# Altium schematic sheet Four_Axis_Remoter_V1.0.0.SchDoc
size A3
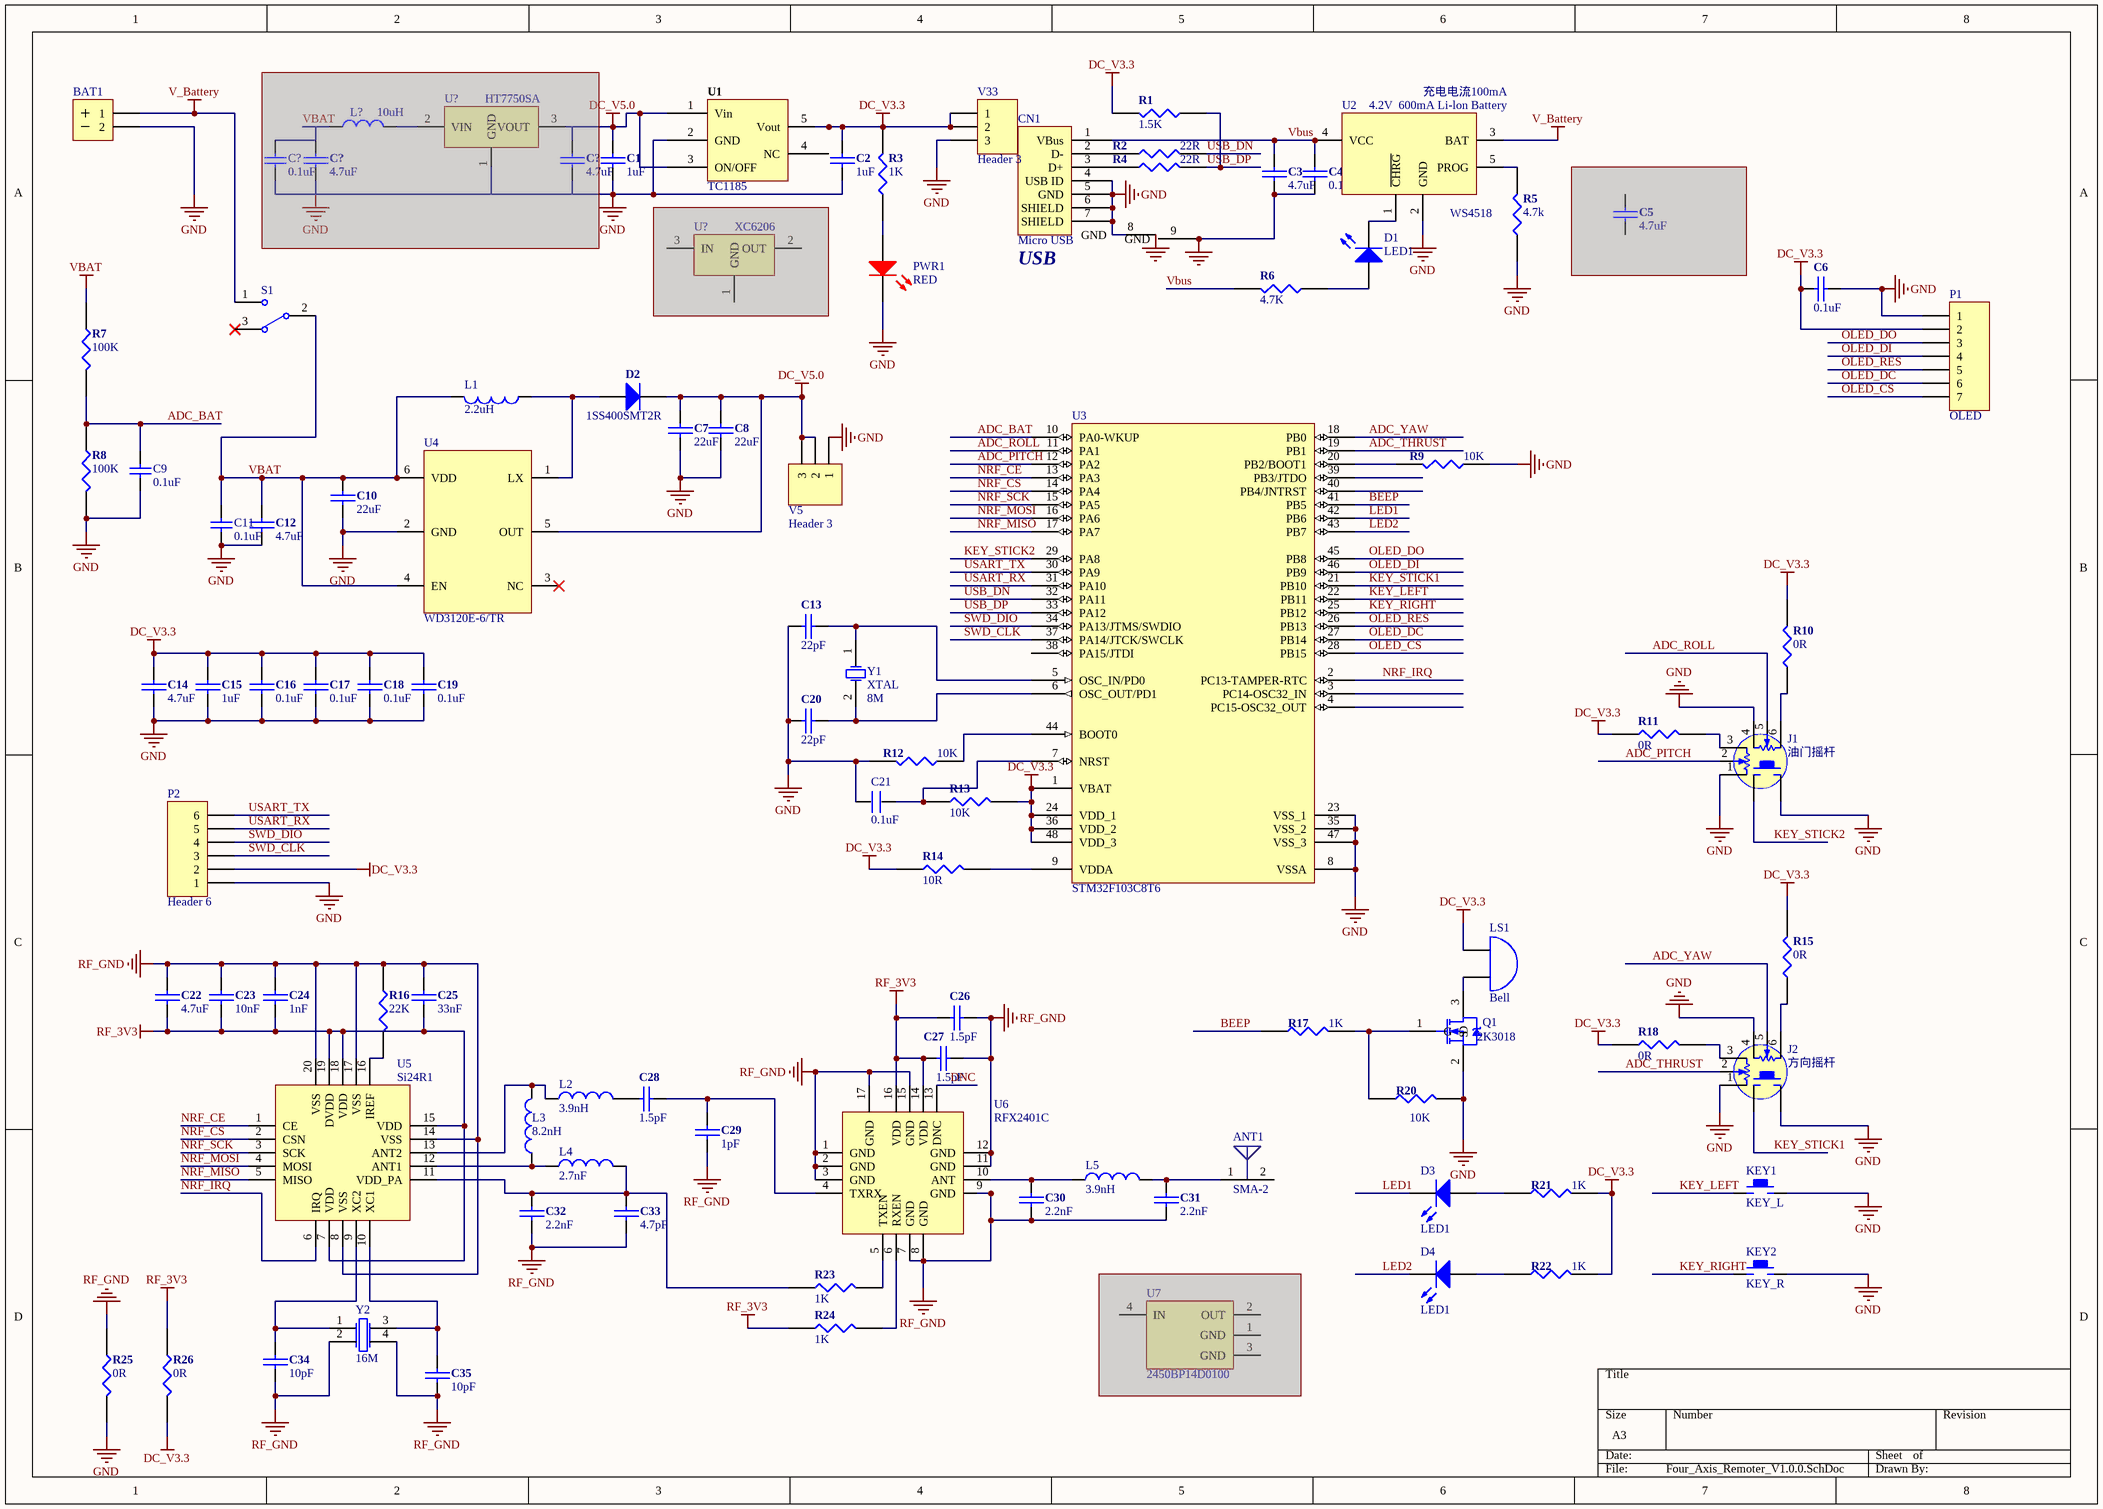
[diagram p0: Four_Axis_Remoter_V1.0.0.SchDoc]

## Parts
(Parts that share a designator on the sheet are numbered #1, #2 ... from top to bottom, then left to right.)
ANT1  SMA-2  [SMB_V-RJ45]
BAT1  BAT  [HDR1X2]  (value not drawn)
C1  1uF  [C0603]
C2  1uF  [C0603]
C3  4.7uF  [C0603]
C4  0.1uF  [C0603]
C5  4.7uF  [C0603]  (masked out: inside a compile mask, not in the netlist)
C6  0.1uF  [C0603]
C7  22uF  [C0603]
C8  22uF  [C0603]
C9  value 0.1uF  [C0603]  (hidden comment: C_0603)
C10  22uF  [C0603]
C11  value 0.1uF  [C0603]  (hidden comment: C_0603)
C12  4.7uF  [C0603]
C13  22pF  [C0603]
C14  4.7uF  [C0603]
C15  1uF  [C0603]
C16  0.1uF  [C0603]
C17  0.1uF  [C0603]
C18  0.1uF  [C0603]
C19  0.1uF  [C0603]
C20  22pF  [C0603]
C21  0.1uF  [C0603]
C22  4.7uF  [C0603]
C23  10nF  [C0603]
C24  1nF  [C0603]
C25  33nF  [C0603]
C26  1.5pF  [C0603]
C27  1.5pF  [C0603]
C28  1.5pF  [C0603]
C29  1pF  [C0603]
C30  2.2nF  [C0603]
C31  2.2nF  [C0603]
C32  2.2nF  [C0603]
C33  4.7pF  [C0603]
C34  10pF  [C0603]
C35  10pF  [C0603]
C?#1  4.7uF  [CC0402]  (masked out: inside a compile mask, not in the netlist)
C?#2  4.7uF  [CC0402]  (masked out: inside a compile mask, not in the netlist)
C?#3  value 0.1uF  [C0603]  (hidden comment: C_0603)  (masked out: inside a compile mask, not in the netlist)
CN1  Micro USB  USAGE: USB  [MICRO_USB_9]
D1  LED1  [LED0603-green]
D2  1SS400SMT2R  [L0603]
D3  LED1  [LED0603-green]
D4  LED1  [LED0603-green]
J1  油门摇杆  [摇杆2]
J2  方向摇杆  [摇杆2]
KEY1  KEY_L  [SW-4PIN-DIP]
KEY2  KEY_R  [SW-4PIN-DIP]
L1  2.2uH  [C0805]
L2  3.9nH  [C0603]
L3  8.2nH  [C0603]
L4  2.7nF  [C0603]
L5  3.9nH  [C0603]
L?  value 10uH  [L_1812]  (hidden comment: Inductor)  (masked out: inside a compile mask, not in the netlist)
LS1  Bell  [BUZZER]
P1  OLED  [HDR1X7]
P2  Header 6  [HDR1X6]
PWR1  RED  [LED0603-green]
Q1  2K3018  [LC-SOT-23(SOT-23-3)]
R1  1.5K  [R0603 - 1]
R2  22R  [R0603 - 1]
R3  1K  [R0603 - 1]
R4  22R  [R0603 - 1]
R5  4.7k  [R0603 - 1]
R6  4.7K  [R0603 - 1]
R7  100K  [R0603 - 1]
R8  100K  [R0603 - 1]
R9  10K  [R0603 - 1]
R10  0R  [R0603 - 1]
R11  0R  [R0603 - 1]
R12  10K  [R0603 - 1]
R13  10K  [R0603 - 1]
R14  10R  [R0603 - 1]
R15  0R  [R0603 - 1]
R16  22K  [R0603 - 1]
R17  1K  [R0603 - 1]
R18  0R  [R0603 - 1]
R20  10K  [R0603 - 1]
R21  1K  [R0603 - 1]
R22  1K  [R0603 - 1]
R23  1K  [R0603 - 1]
R24  1K  [R0603 - 1]
R25  0R  [R0603 - 1]
R26  0R  [R0603 - 1]
S1  SW-SPDT  [SWITCH_PWR]  (value not drawn)
U1  TC1185  [SOT-23-5]
U2  WS4518  [SOT-23-5]
U3  STM32F103C8T6  [LQFP48S]
U4  WD3120E-6/TR  [SOT23-6]
U5  Si24R1  [QFN-20_4x4]
U6  RFX2401C  [QFN16]
U7  2450BP14D0100  [BALUN_250BP]  (masked out: inside a compile mask, not in the netlist)
U?#1  HT7750SA  [SOT-89(SOT-89-3)]  (masked out: inside a compile mask, not in the netlist)
U?#2  XC6206  [SOT-23-3]  (masked out: inside a compile mask, not in the netlist)
V5  Header 3  [HDR1X3]
V33  Header 3  [HDR1X3]
Y1  XTAL  [XTAL - 2]
Y2  16M  [CRYSTAL_RSX-10]

## Nets
DC_V3.3: C2.2 C6.2 C14.2 C15.2 C16.2 C17.2 C18.2 C19.2 LS1.1(A) P1.2 P2.2 R1.2 R3.2 R10.2 R11.1 R13.2 R14.1 R15.2 R18.1 R21.2 R22.2 R26.2 U1.5(Vout) U3.1(VBAT) U3.24(VDD_1) U3.36(VDD_2) U3.48(VDD_3) V33.1 V33.2
DC_V5.0: C1.2 C7.2 C8.2 D2.2(K) U1.1(Vin) U1.3(ON/OFF) U4.5(OUT) V5.2 V5.3
GND: BAT1.2 C1.1 C2.1 C3.1 C4.1 C6.1 C7.1 C8.1 C9.1 C10.1 C11.1 C12.1 C13.1 C14.1 C15.1 C16.1 C17.1 C18.1 C19.1 C20.1 C21.1 CN1.4(USB_ID) CN1.5(GND) CN1.6(SHIELD) CN1.7(SHIELD) CN1.8(GND) CN1.9(GND) J1.1 J1.4 J1.J1 J2.1 J2.4 J2.J1 KEY1.2 KEY2.2 P1.1 P2.1 PWR1.2(K) Q1.2(S) R5.1 R8.2 R9.1 R12.2 R20.2 R25.2 U1.2(GND) U2.2(GND) U3.8(VSSA) U3.23(VSS_1) U3.35(VSS_2) U3.47(VSS_3) U4.2(GND) V5.1 V33.3
RF_3V3: C22.1 C23.1 C24.1 C25.1 C26.2 C27.2 R24.1 R26.1 U5.7(VDD) U5.15(VDD) U5.18(VDD) U5.19(DVDD) U6.14(VDD) U6.16(VDD)
RF_GND: C22.2 C23.2 C24.2 C25.2 C26.1 C27.1 C29.2 C30.2 C31.2 C32.2 C33.2 C34.1 C35.1 R16.1 R25.1 U5.8(VSS) U5.14(VSS) U5.17(VSS) U5.20(VSS) U6.1(GND) U6.2(GND) U6.3(GND) U6.7(GND) U6.8(GND) U6.9(GND) U6.11(GND) U6.12(GND) U6.15(GND) U6.17(GND) Y2.2(OSC1) Y2.4(OSC2)
V_Battery: BAT1.1 S1.1 U2.3(BAT)
VBAT: C10.2 C11.2 C12.2 L1.2 R7.1 S1.2 U4.4(EN) U4.6(VDD)
ADC_BAT: C9.2 R7.2 R8.1 U3.10(PA0-WKUP)
ADC_PITCH: J1.2 U3.12(PA2)
ADC_ROLL: J1.5 U3.11(PA1)
ADC_THRUST: J2.2 U3.19(PB1)
ADC_YAW: J2.5 U3.18(PB0)
BEEP: R17.1 U3.41(PB5)
DNC: U6.13(DNC)
KEY_LEFT: KEY1.1 U3.22(PB11)
KEY_RIGHT: KEY2.1 U3.25(PB12)
KEY_STICK1: J2.J2 U3.21(PB10)
KEY_STICK2: J1.J2 U3.29(PA8)
LED1: D3.2(K) U3.42(PB6)
LED2: D4.2(K) U3.43(PB7)
NRF_CE: U3.13(PA3) U5.1(CE)
NRF_CS: U3.14(PA4) U5.2(CSN)
NRF_IRQ: U3.2(PC13-TAMPER-RTC) U5.6(IRQ)
NRF_MISO: U3.17(PA7) U5.5(MISO)
NRF_MOSI: U3.16(PA6) U5.4(MOSI)
NRF_SCK: U3.15(PA5) U5.3(SCK)
OLED_CS: P1.7 U3.28(PB15)
OLED_DC: P1.6 U3.27(PB14)
OLED_DI: P1.4 U3.46(PB9)
OLED_DO: P1.3 U3.45(PB8)
OLED_RES: P1.5 U3.26(PB13)
SWD_CLK: P2.3 U3.37(PA14/JTCK/SWCLK)
SWD_DIO: P2.4 U3.34(PA13/JTMS/SWDIO)
USART_RX: P2.5 U3.31(PA10)
USART_TX: P2.6 U3.30(PA9)
USB_DN: R2.2 U3.32(PA11)
USB_DP: R1.1 R4.2 U3.33(PA12)
Vbus: C3.2 C4.2 CN1.1(VBus) R6.2 U2.4(VCC)
NetANT1_1: ANT1.1(FP) C31.1 L5.2
NetC13_2: C13.2 U3.5(OSC_IN/PD0) Y1.1(OSC1)
NetC20_2: C20.2 U3.6(OSC_OUT/PD1) Y1.2(OSC2)
NetC21_2: C21.2 R13.1 U3.7(NRST)
NetC28_1: C28.1 C29.1 U6.4(TXRX)
NetC28_2: C28.2 L2.2
NetC30_1: C30.1 L5.1 U6.10(ANT)
NetC32_1: C32.1 C33.1 L4.2 R23.1 U5.11(VDD_PA)
NetC34_2: C34.2 U5.9(XC2) Y2.1(OSC1)
NetC35_2: C35.2 U5.10(XC1) Y2.3(OSC2)
NetCN1_2: CN1.2(D-) R2.1
NetCN1_3: CN1.3(D+) R4.1
NetD1_1: D1.1(A) R6.1
NetD1_2: D1.2(K) U2.1(~{CHRG})
NetD2_1: D2.1(A) L1.1 U4.1(LX)
NetD3_1: D3.1(A) R21.1
NetD4_1: D4.1(A) R22.1
NetJ1_3: J1.3 R11.2
NetJ1_6: J1.6 R10.1
NetJ2_3: J2.3 R18.2
NetJ2_6: J2.6 R15.1
NetL2_1: L2.1 L3.2 U5.13(ANT2)
NetL3_1: L3.1 L4.1 U5.12(ANT1)
NetLS1_2: LS1.2(B) Q1.3(D)
NetPWR1_1: PWR1.1(A) R3.1
NetQ1_1: Q1.1(G) R17.2 R20.1
NetR5_2: R5.2 U2.5(PROG)
NetR9_2: R9.2 U3.20(PB2/BOOT1)
NetR12_1: R12.1 U3.44(BOOT0)
NetR14_2: R14.2 U3.9(VDDA)
NetR16_2: R16.2 U5.16(IREF)
NetR23_2: R23.2 U6.5(TXEN)
NetR24_2: R24.2 U6.6(RXEN)

Not connected (* = marked no-connect by the designer): ANT1 2(NC); S1 3*; U1 4(NC); U3 3(PC14-OSC32_IN) 4(PC15-OSC32_OUT) 38(PA15/JTDI) 39(PB3/JTDO) 40(PB4/JNTRST); U4 3(NC)*

## Notes on the sheet
- (near U2) 4.2V  600mA Li-lon Battery
- (near U2) 充电电流100mA
- (in symbol XTAL) 8M

## Library data of the parts
ANT1 = CHIP_ANTENNA
BAT1 = BAT: Header, 2-Pin; Publisher: mazhongwei; Published: 8-August-2017; PackageReference: HDR1X2
C1-C6 C12 C?#1 C?#2 = 电容: Precision: 6.3V耐压; LIB: SMT电容
C7 C8 C10 C13-C20 C22-C35 = CAP: SMT电容; Precision: 6.3V耐压
  C13-C20 C22-C35: LIB: SMT电容
C21 = C
CN1 = Mini_USB_2: MINI USBͷ
D1 D3 D4 = LED0: Typical INFRARED GaAs LED; Published: 8-Jun-2000; LatestRevisionDate: 08-Jul-2005; LatestRevisionNote: Mech Layer 1 removed.; PackageReference: LED-0; Publisher: Altium Limited; PackageDescription: LED; 2 Leads
D2 = Diode 1N914: 二极管; Published: 8-Jun-2000; LatestRevisionDate: 17-Jul-2002; LatestRevisionNote: Re-released for DXP Platform.; DatasheetDocument: 1997; PackageReference: DO-35; Publisher: Altium Limited; Code_JEDEC: DO-204-AH; ComponentLink1Description: Manufacturer Link; ComponentLink1URL: http://www.fairchildsemi.com/; ComponentLink2Description: Datasheet; ComponentLink2URL: http://www.fairchildsemi.com/ds/1N%2F1N4448.pdf
J1 J2 = 摇杆_1: 摇杆
KEY1 KEY2 = KEY
L1 = Inductor: Code_IEC: 1005; Value: 10mH; Published: 8-Jun-2000; LatestRevisionDate: 17-Jul-2002; LatestRevisionNote: Re-released for DXP Platform.; PackageReference: 0402-A; Publisher: Altium Limited; Code_JEITA: 0402
L2-L5 = Inductor: Code_IEC: 1005; Value: 10mH; Precision: +5%精度; Published: 8-Jun-2000; LatestRevisionDate: 17-Jul-2002; LatestRevisionNote: Re-released for DXP Platform.; PackageReference: 0402-A; Publisher: Altium Limited; Code_JEITA: 0402
L? = Inductor: 电感; Code_IEC: 1005; Published: 8-Jun-2000; LatestRevisionDate: 17-Jul-2002; LatestRevisionNote: Re-released for DXP Platform.; PackageReference: 0402-A; Publisher: Altium Limited; Code_JEITA: 0402
LS1 = Bell: Electrical Bell; Published: 24-Mar-1999; LatestRevisionDate: 17-Jul-2002; LatestRevisionNote: Re-released for DXP Platform.; PackageReference: PIN2; Publisher: Altium Limited
P1 = Header 7: Header, 7-Pin; LatestRevisionDate: 17-Jul-2002; LatestRevisionNote: Re-released for DXP Platform.; Publisher: Altium Limited
P2 = Header 6: Header, 6-Pin; LatestRevisionDate: 17-Jul-2002; LatestRevisionNote: Re-released for DXP Platform.; Publisher: Altium Limited
PWR1 = LED1
Q1 = NMOS-2: N-Channel Power MOSFET; Note: Pin 2 is electrically connected to pin 4.; Published: 8-Jun-2000; LatestRevisionDate: 17-Jul-2002; LatestRevisionNote: Re-released for DXP Platform.; DatasheetVersion: PD-9.814; PackageVersion: Feb-1997; PackageReference: TO-220AB; Publisher: Altium Limited; PackageDescription: TO, Thru-Hole, Vertical, Heatsink Mounted; 3 In-Line Leads; Pitch 2.54 mm; ComponentLink1Description: Manufacturer Link; ComponentLink1URL: http://www.irf.com/
R1-R18 R20-R26 = RES1: SMT电阻; Precision: 5% 精度; LIB: SMT 电阻
S1 = SW-SPDT: SPDT Subminiature Toggle Switch, Right Angle Mounting, Vertical Actuation; Published: 10-August-2017; PackageReference: SWITCH_PWR; Publisher: mazhongwei
U1 = S1132: DC-DC
U2 = LTC4054
U3 = STM32F103C8T6: STM32 ARM-based 32-bit MCU with 64 Kbytes Flash, 48-pin LQFP, Industrial Temperature; Published: 30-May-2008; DatasheetVersion: rev6, Mar-2008; PackageVersion: Mar-2008; PackageReference: LQFP48; Publisher: Altium Limited; PackageDescription: 48-Pin Low-Profile Quad Flat Pack, 7 x 7 mm Body, 0.5 mm Pitch (LQFP48); ComponentLink1Description: Manufacturer Link; ComponentLink1URL: www.st.com/stm32; ComponentLink2Description: Datasheet; ComponentLink2URL: http://www.st.com/stonline/products/literature/ds/13587.pdf
U4 = S-8261: Precision: 电池保护IC; SMT: 贴片SOT23-6
U5 = nRF24L01
U7 = BALUN_1
V5 V33 = Header 3: Header, 3-Pin; LatestRevisionDate: 17-Jul-2002; LatestRevisionNote: Re-released for DXP Platform.; Publisher: Altium Limited
Y1 = XTAL: Crystal Oscillator; Published: 8-Jun-2000; LatestRevisionDate: 17-Jul-2002; LatestRevisionNote: Re-released for DXP Platform.; Publisher: Altium Limited
Y2 = XTAL-4: Crystal Oscillator; Published: 8-Jun-2000; LatestRevisionDate: 17-Jul-2002; LatestRevisionNote: Re-released for DXP Platform.; PackageReference: R38; Publisher: Altium Limited
C9 C11 C?#3 = C_0603: Published: 8-Jun-2000; LatestRevisionDate: 17-Jul-2002; LatestRevisionNote: Re-released for DXP Platform.; PackageReference: RAD-0.3; Publisher: Altium Limited; PackageDescription: Radial Cap, Thru-Hole; 2 Leads; 0.3 in Pin Spacing
U?#2 = XC6206: PackageReference: SOT23-3; Published: 12-August-2017; Publisher: mazhongwei